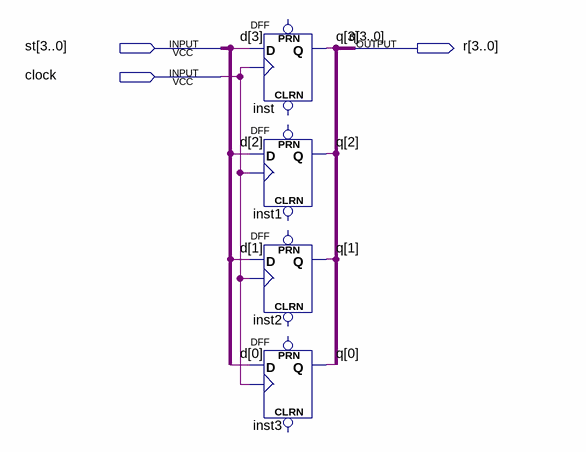
[diagram p0: schematic sheet]
// Quartus schematic sm_r.bdf as structural Verilog: 4 symbols, 3 pins
module sm_r (
  input  [3:0] st,
  input  clock,
  output [3:0] r
);

  wire [3:0] d;

  DFF inst (.CLK(clock), .D(d[3]), .Q(r[3]));  // open: CLRN, PRN
  DFF inst1 (.CLK(clock), .D(d[2]), .Q(r[2]));  // open: CLRN, PRN
  DFF inst2 (.CLK(clock), .D(d[1]), .Q(r[1]));  // open: CLRN, PRN
  DFF inst3 (.CLK(clock), .D(d[0]), .Q(r[0]));  // open: CLRN, PRN

  // Other names for the same wires on the sheet: q[3:0] = r
endmodule
